# Altium schematic sheet GPIO.SchDoc: GPIO
size A3; Author: Eladio Delgado Mingorance; CompanyName: bq - Mundo Reader; Organization: bq - Mundo Reader; Revision: 1.4; SheetNumber: 2; SheetTotal: 10
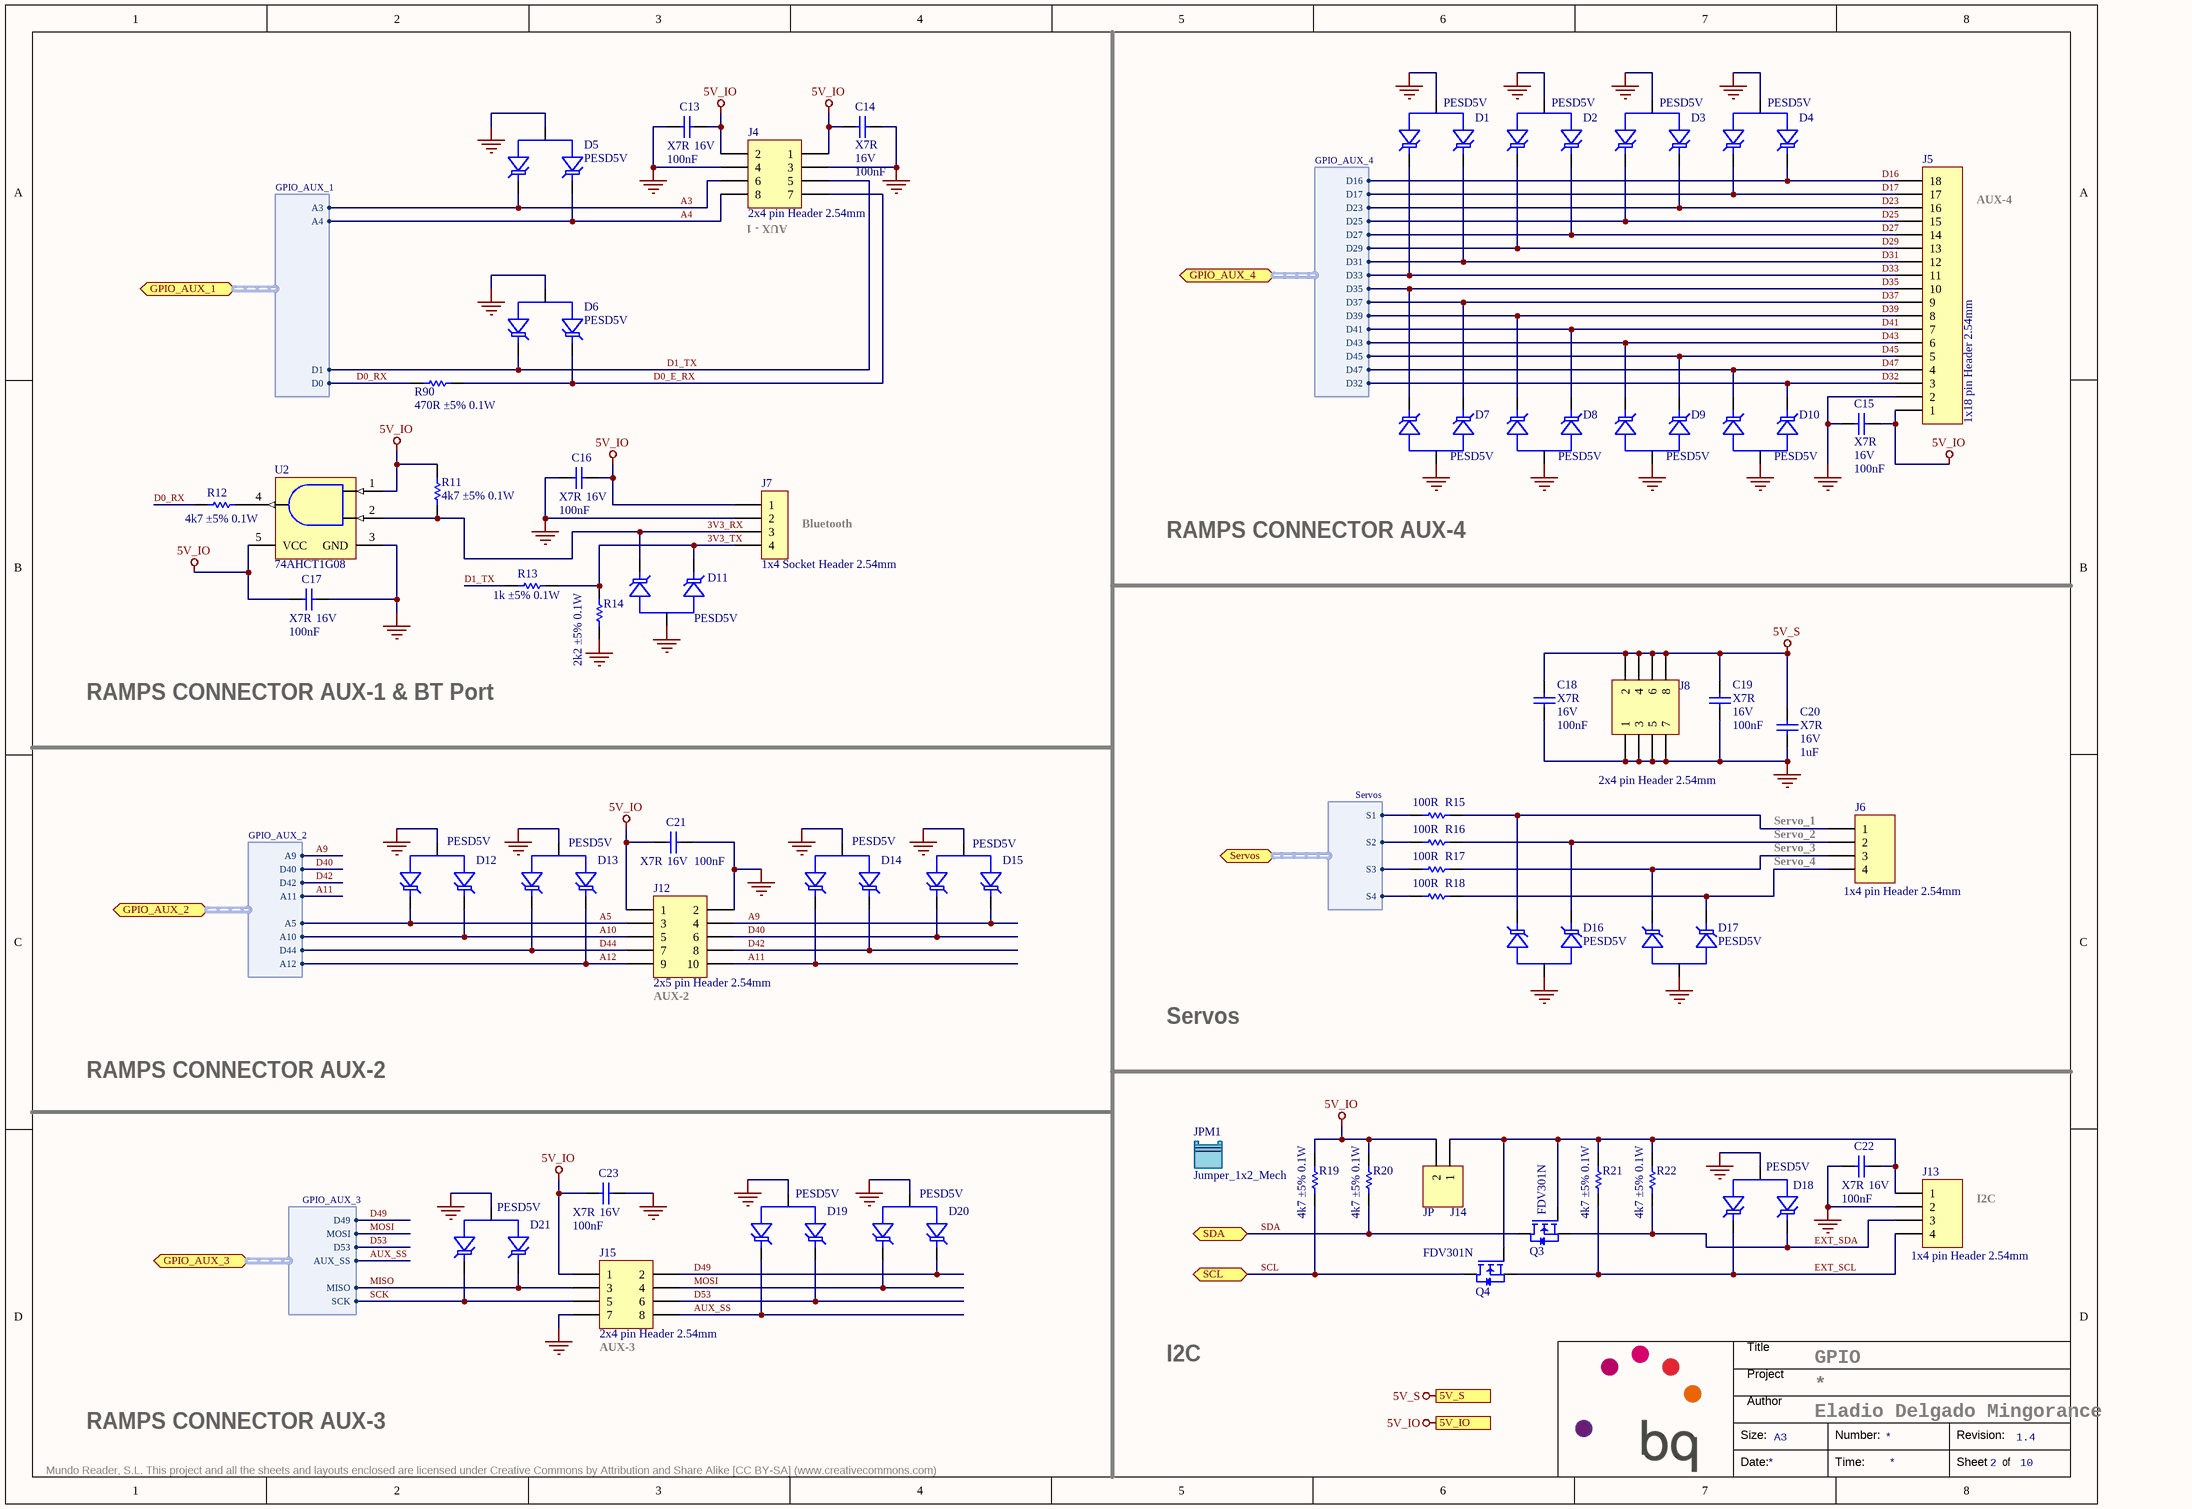
[diagram p0: GPIO.SchDoc]

## Parts
C13  Dielectric: X7R  Voltage: 16V  Capacitance: 100nF  [C0603]  (hidden comment: Capacitor)
C14  Dielectric: X7R  Voltage: 16V  Capacitance: 100nF  [C0603]  (hidden comment: Capacitor)
C15  Dielectric: X7R  Voltage: 16V  Capacitance: 100nF  [C0603]  (hidden comment: Capacitor)
C16  Dielectric: X7R  Voltage: 16V  Capacitance: 100nF  [C0603]  (hidden comment: Capacitor)
C17  Dielectric: X7R  Voltage: 16V  Capacitance: 100nF  [C0603]  (hidden comment: Capacitor)
C18  Dielectric: X7R  Voltage: 16V  Capacitance: 100nF  [C0603]  (hidden comment: Capacitor)
C19  Dielectric: X7R  Voltage: 16V  Capacitance: 100nF  [C0603]  (hidden comment: Capacitor)
C20  Dielectric: X7R  Voltage: 16V  Capacitance: 1uF  [C0603]  (hidden comment: Capacitor)
C21  Dielectric: X7R  Voltage: 16V  Capacitance: 100nF  [C0603]  (hidden comment: Capacitor)
C22  Dielectric: X7R  Voltage: 16V  Capacitance: 100nF  [C0603]  (hidden comment: Capacitor)
C23  Dielectric: X7R  Voltage: 16V  Capacitance: 100nF  [C0603]  (hidden comment: Capacitor)
D1  PESD5V  [SOT323_3_SC70]
D2  PESD5V  [SOT323_3_SC70]
D3  PESD5V  [SOT323_3_SC70]
D4  PESD5V  [SOT323_3_SC70]
D5  PESD5V  [SOT323_3_SC70]
D6  PESD5V  [SOT323_3_SC70]
D7  PESD5V  [SOT323_3_SC70]
D8  PESD5V  [SOT323_3_SC70]
D9  PESD5V  [SOT323_3_SC70]
D10  PESD5V  [SOT323_3_SC70]
D11  PESD5V  [SOT323_3_SC70]
D12  PESD5V  [SOT323_3_SC70]
D13  PESD5V  [SOT323_3_SC70]
D14  PESD5V  [SOT323_3_SC70]
D15  PESD5V  [SOT323_3_SC70]
D16  PESD5V  [SOT323_3_SC70]
D17  PESD5V  [SOT323_3_SC70]
D18  PESD5V  [SOT323_3_SC70]
D19  PESD5V  [SOT323_3_SC70]
D20  PESD5V  [SOT323_3_SC70]
D21  PESD5V  [SOT323_3_SC70]
J4  2x4 pin Header 2.54mm  [2x4 Pin Header 2.54]
J5  1x18 pin Header 2.54mm  [1x18 Pin Header 2.54]
J6  1x4 pin Header 2.54mm  [1x4 Pin Header 2.54]
J7  1x4 Socket Header 2.54mm  [1x4 Socket Header THT 2.54mm]
J8  2x4 pin Header 2.54mm  [2x4 Pin Header 2.54]
J12  2x5 pin Header 2.54mm  [2x5 Pin Header 2.54]
J13  1x4 pin Header 2.54mm  [1x4 Pin Header 2.54]
J14  JP  [1x2 Pin Header 2.54]
J15  2x4 pin Header 2.54mm  [2x4 Pin Header 2.54]
JPM1  Jumper_1x2_Mech  (mechanical)
Q3  FDV301N  [SOT23-3]
Q4  FDV301N  [SOT23-3]
R11  value 4k7 ±5% 0.1W  [R0603]  (hidden comment: Resistor)
R12  value 4k7 ±5% 0.1W  [R0603]  (hidden comment: Resistor)
R13  value 1k ±5% 0.1W  [R0603]  (hidden comment: Resistor)
R14  value 2k2 ±5% 0.1W  [R0603]  (hidden comment: Resistor)
R15  Resistance: 100R  [R0603]
R16  Resistance: 100R  [R0603]
R17  Resistance: 100R  [R0603]
R18  Resistance: 100R  [R0603]
R19  value 4k7 ±5% 0.1W  [R0603]  (hidden comment: Resistor)
R20  value 4k7 ±5% 0.1W  [R0603]  (hidden comment: Resistor)
R21  value 4k7 ±5% 0.1W  [R0603]  (hidden comment: Resistor)
R22  value 4k7 ±5% 0.1W  [R0603]  (hidden comment: Resistor)
R90  value 470R ±5% 0.1W  [R0603]  (hidden comment: Resistor)
U2  74AHCT1G08  [SOT23-5]

## Ports
5V_IO, 5V_S, GPIO_AUX_1 (harness GPIO_AUX_1), GPIO_AUX_2 (harness GPIO_AUX_2), GPIO_AUX_3 (harness GPIO_AUX_3), GPIO_AUX_4 (harness GPIO_AUX_4), SCL (bidir), SDA (bidir), Servos (harness Servos)

## Harnesses
GPIO_AUX_4: D16, D17, D23, D25, D27, D29, D31, D33, D35, D37, D39, D41, D43, D45, D47, D32
Servos: S1, S2, S3, S4
GPIO_AUX_1: A3, A4, D0, D1
GPIO_AUX_2: A5, A10, D44, A12, A9, D40, D42, A11
GPIO_AUX_3: D49, MOSI, D53, MISO, SCK, AUX_SS

## Nets
5V_IO: C13.1 C14.1 C15.1 C16.1 C17.2 C21.2 C23.2 J4.1 J4.2 J5.1 J7.1 J12.1 J14.2 J15.1 R11.2 R19.1 R20.1 U2.1(A) U2.5(VCC) ; port 5V_IO
5V_S: C18.2 C19.2 C20.2 J8.2 J8.4 J8.6 J8.8 ; port 5V_S
GND: C13.2 C14.2 C15.2 C16.2 C17.1 C18.1 C19.1 C20.1 C21.1 C22.2 C23.1 D1.3 D2.3 D3.3 D4.3 D5.3 D6.3 D7.3 D8.3 D9.3 D10.3 D11.3 D12.3 D13.3 D14.3 D15.3 D16.3 D17.3 D18.3 D19.3 D20.3 D21.3 J4.3 J4.4 J5.2 J7.2 J8.1 J8.3 J8.5 J8.7 J12.2 J13.2 J15.7 R14.1 U2.3(GND)
3V3_RX: D11.2 J7.3 R11.1 U2.2(B)
3V3_TX: D11.1 J7.4 R13.2 R14.2
A3: D5.1 J4.6 ; port GPIO_AUX_1.A3
A4: D5.2 J4.8 ; port GPIO_AUX_1.A4
A5: D12.2 J12.3 ; port GPIO_AUX_2.A5
A9: D15.1 J12.4 ; port GPIO_AUX_2.A9
A10: D12.1 J12.5 ; port GPIO_AUX_2.A10
A11: D14.2 J12.10 ; port GPIO_AUX_2.A11
A12: D13.1 J12.9 ; port GPIO_AUX_2.A12
AUX_SS: D19.2 J15.8 ; port GPIO_AUX_3.AUX_SS
D0_E_RX: D6.1 J4.7 R90.1
D0_RX: R12.2 R90.2 ; port GPIO_AUX_1.D0
D1_TX: D6.2 J4.5 R13.1 ; port GPIO_AUX_1.D1
D16: D4.2 J5.18 ; port GPIO_AUX_4.D16
D17: D4.1 J5.17 ; port GPIO_AUX_4.D17
D23: D3.2 J5.16 ; port GPIO_AUX_4.D23
D25: D3.1 J5.15 ; port GPIO_AUX_4.D25
D27: D2.2 J5.14 ; port GPIO_AUX_4.D27
D29: D2.1 J5.13 ; port GPIO_AUX_4.D29
D31: D1.2 J5.12 ; port GPIO_AUX_4.D31
D32: D10.1 J5.3 ; port GPIO_AUX_4.D32
D33: D1.1 J5.11 ; port GPIO_AUX_4.D33
D35: D7.2 J5.10 ; port GPIO_AUX_4.D35
D37: D7.1 J5.9 ; port GPIO_AUX_4.D37
D39: D8.2 J5.8 ; port GPIO_AUX_4.D39
D40: D15.2 J12.6 ; port GPIO_AUX_2.D40
D41: D8.1 J5.7 ; port GPIO_AUX_4.D41
D42: D14.1 J12.8 ; port GPIO_AUX_2.D42
D43: D9.2 J5.6 ; port GPIO_AUX_4.D43
D44: D13.2 J12.7 ; port GPIO_AUX_2.D44
D45: D9.1 J5.5 ; port GPIO_AUX_4.D45
D47: D10.2 J5.4 ; port GPIO_AUX_4.D47
D49: D20.1 J15.2 ; port GPIO_AUX_3.D49
D53: D19.1 J15.6 ; port GPIO_AUX_3.D53
EXT_SCL: D18.1 J13.4 Q4.2(S) R21.2
EXT_SDA: D18.2 J13.3 Q3.2(S) R22.2
MISO: D21.2 J15.3 ; port GPIO_AUX_3.MISO
MOSI: D20.2 J15.4 ; port GPIO_AUX_3.MOSI
SCK: D21.1 J15.5 ; port GPIO_AUX_3.SCK
SCL: Q4.3(D) R19.2 ; port SCL
SDA: Q3.3(D) R20.2 ; port SDA
NetC22_1: C22.1 J13.1 J14.1 Q3.1(G) Q4.1(G) R21.1 R22.1
NetD16_1: D16.1 J6.1 R15.2
NetD16_2: D16.2 J6.2 R16.2
NetD17_1: D17.1 J6.3 R17.2
NetD17_2: D17.2 J6.4 R18.2
NetR12_1: R12.1 U2.4(Y)
NetR15_1: R15.1 ; port Servos.S1
NetR16_1: R16.1 ; port Servos.S2
NetR17_1: R17.1 ; port Servos.S3
NetR18_1: R18.1 ; port Servos.S4

## Notes on the sheet
- (near J4) AUX - 1
- AUX-4
- (near J7) Bluetooth
- RAMPS CONNECTOR AUX-4
- RAMPS CONNECTOR AUX-1 & BT Port
- (near J6) Servo_1
- (near J6) Servo_2
- (near J6) Servo_3
- (near J6) Servo_4
- (near J12) AUX-2
- Servos
- RAMPS CONNECTOR AUX-2
- I2C
- (near J15) AUX-3
- RAMPS CONNECTOR AUX-3
- Title
- Project
- Size:
- Author
- A3
- Number:
- Revision:
- Mundo Reader, S.L. This project and all the sheets and layouts enclosed are licensed under Creative Commons by Attribution and Share Alike [CC BY-SA] (www.creativecommons.com)
- Date:
- Time:
- Sheet
- of

## Library data of the parts
C13-C19 C21-C23 = C0603_100nF_16V_±10%: Manufacturer: Kemet; Value: 100nF ±10% 16V; Tolerance: ±10%; OrderingCode: C0603C104K4RAC; Temp_ Max: 125; Temp_ Min: -55; Part Number: C0603_100nF_16V_±10%; Price (€): 0,012
C20 = C0603_1uF_16V_±10%_X7R: Manufacturer: TDK; Value: 1uF ±10% 16V; Tolerance: ±10%; OrderingCode: C1608X7R1C105K080AC; Temp_ Max: 125; Temp_ Min: -55; OrderingCode 2: C0603C105K4RACTU; Part Number: C0603_1uF_16V_±10%_X7R; Price (€): 0,018; Manufacturer 2: Kemet
D1-D21 = PESD5V: Dual ESD protection diode; Manufacturer: NXP; OrderingCode: PESD5V0L2UU,115; Temp_ Max: 150; Temp_ Min: -65; OrderingCode 2: DF3A6.8FUT1G; Part Number: PESD5V; Price (€): 0,071; Manufacturer 2: ON Semiconductor
J4 J8 = CON_DPH_THT2.54_8: Connector, 8 pin Dual Header 2.54mm; Manufacturer: Samtec; OrderingCode: TSW-104-07-T-D; Temp_ Max: 125; Temp_ Min: -40; OrderingCode 2: 613 008 211 21; Value: 8; Pitch: 2.54mm; Part Number: CON_DPH_THT2.54_8; Supplier: Samtec; Price (€): 0,305; Manufacturer 2: Würth Elektronik
J5 = CON_PH_THT2.54_18: Manufacturer: Samtec; OrderingCode: TSW-118-07-T-S; Temp_ Max: 105; Temp_ Min: -55; OrderingCode 2: 613 018 111 21; Value: 18; Pitch: 2.54mm; Part Number: CON_PH_THT2.54_18; Supplier: Samtec; Price (€): 0,737; Manufacturer 2: Würth Elektronik
J6 J13 = CON_PH_THT2.54_4: Manufacturer: Samtec; OrderingCode: TSW-104-07-T-S; Temp_ Max: 105; Temp_ Min: -55; OrderingCode 2: 613 004 111 21; Value: 4; Pitch: 2.54mm; Part Number: CON_PH_THT2.54_4; Supplier: Samtec; Price (€): 0,211; Manufacturer 2: Würth Elektronik
J7 = CON_SH_THT2.54_4: 4 pin Socket Header 2.54mm; Manufacturer: Samtec; OrderingCode: SSW-104-01-T-S; Temp_ Max: 125; Temp_ Min: -40; OrderingCode 2: 613 004 118 21; Value: 4; Part Number: CON_SH_THT2.54_4; Supplier: Samtec; Manufacturer 2: Würth Elektronik; Price (€): 0,342
J12 = CON_DPH_THT2.54_10: 10 pin Dual Header 2.54mm; Manufacturer: Samtec; OrderingCode: TSW-105-07-T-D; Temp_ Max: 125; Temp_ Min: -40; OrderingCode 2: 613 010 211 21; Value: 10; Pitch: 2.54mm; Part Number: CON_DPH_THT2.54_10; Supplier: Samtec; Price (€): 0,368; Manufacturer 2: Würth Elektronik
J14 = CON_PH_THT2.54_2: 1x2 pin Header 2.54mm; Manufacturer: Samtec; OrderingCode: TSW-102-07-T-S; Temp_ Max: 105; Temp_ Min: -55; OrderingCode 2: 613 002 111 21; Value: 2; Part Number: CON_PH_THT2.54_2; Supplier: Samtec; Price (€): 0,106; Manufacturer 2: Würth Elektronik
J15 = CON_DPH_THT2.54_8: 8 pin Dual Header 2.54mm; Manufacturer: Samtec; OrderingCode: TSW-104-07-T-D; Temp_ Max: 125; Temp_ Min: -40; OrderingCode 2: 613 008 211 21; Value: 8; Pitch: 2.54mm; Part Number: CON_DPH_THT2.54_8; Supplier: Samtec; Price (€): 0,305; Manufacturer 2: Würth Elektronik
JPM1 = Jumper_2pin_Mech: Connector, Jumper, 1x2 Jumper 2.54mm; Manufacturer: Würth; OrderingCode: 609 002 136 21; Temp_ Max: 125; Temp_ Min: -40; Value: Blue 1x2; Part Number: Jumper_2pin_Mech; Supplier: Würth; Price (€): 0,05
Q3 Q4 = FDV301N: Mosfet Channel N Enhancement Mode; Manufacturer: Fairchild Semiconductor; Vds: 25V; Vgss: 8V; Id: 0,22A; Temp_ Max: 150; Temp_ Min: -55; OrderingCode 2: DMG301NU-13; Part Number: FDV301N; OrderingCode: FDV301N; Price (€): 0,026; Manufacturer 2: Diode
R11 = R0603_4k7_0.1W_±5%: Resistor, SMD; Manufacturer: Vishay; Tolerance: ±5%; OrderingCode: CRCW06034K70JN; Power: 0.1W; Resistance: 4k7; Temp_ Max: 155; Temp_ Min: -55; PackageDescription: SMD; Part Number: R0603_4k7_0.1W_±5%; Price (€): 0,003
R12 R19-R22 = R0603_4k7_0.1W_±5%: Manufacturer: Vishay; Tolerance: ±5%; OrderingCode: CRCW06034K70JN; Power: 0.1W; Resistance: 4k7; Temp_ Max: 155; Temp_ Min: -55; PackageDescription: SMD; Part Number: R0603_4k7_0.1W_±5%; Price (€): 0,003
R13 = R0603_1k_0.1W_±5%: Manufacturer: Vishay; Tolerance: ±5%; OrderingCode: CRCW06031K00JN; Power: 0.1W; Resistance: 1k; Temp_ Max: 155; Temp_ Min: -55; PackageDescription: SMD; Part Number: R0603_1k_0.1W_±5%; Price (€): 0,003
R14 = R0603_2k2_0.1W_±5%: Manufacturer: Vishay; Tolerance: ±5%; OrderingCode: CRCW06032K20JN; Power: 0.1W; Resistance: 2k2; Temp_ Max: 155; Temp_ Min: -55; PackageDescription: SMD; Part Number: R0603_2k2_0.1W_±5%; Price (€): 0,003
R15-R18 = R0603_100R_0.1W_±5%: Resistor; Manufacturer: Vishay; Tolerance: ±5%; OrderingCode: CRCW0603100RJN; Power: 0.1W; Value: 100R ±5% 0.1W; Temp_ Max: 155; Temp_ Min: -55; PackageDescription: SMD; Part Number: R0603_100R_0.1W_±5%; Price (€): 0,003
R90 = R0603_470R_0.1W_±5%: Resistor, SMD; Manufacturer: Vishay; Tolerance: ±5%; OrderingCode: CRCW0603470RJN; Power: 0.1W; Resistance: 470R; Temp_ Max: 155; Temp_ Min: -55; PackageDescription: SMD; Part Number: R0603_470R_0.1W_±5%; Price (€): 0,003
U2 = SN74AHCT1G08: Dual AND Gate Single Ouput; Manufacturer: Texas Instruments; OrderingCode: SN74AHCT1G08DBVR; Temp_ Max: 85; Temp_ Min: -40; Part Number: SN74AHCT1G08; Supplier: Silica; Price (€): 0,082